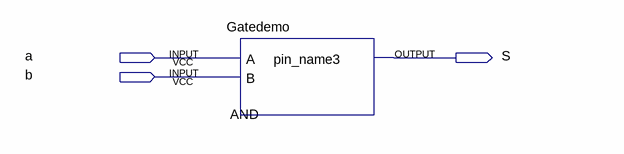
[diagram p0: schematic sheet]
// Quartus schematic GateDemo2.bdf as structural Verilog: 1 symbols, 3 pins
module GateDemo2 (
  input  a,
  input  b,
  output S
);

  Gatedemo AND (.A(a), .B(b), .pin_name3(S));
endmodule
